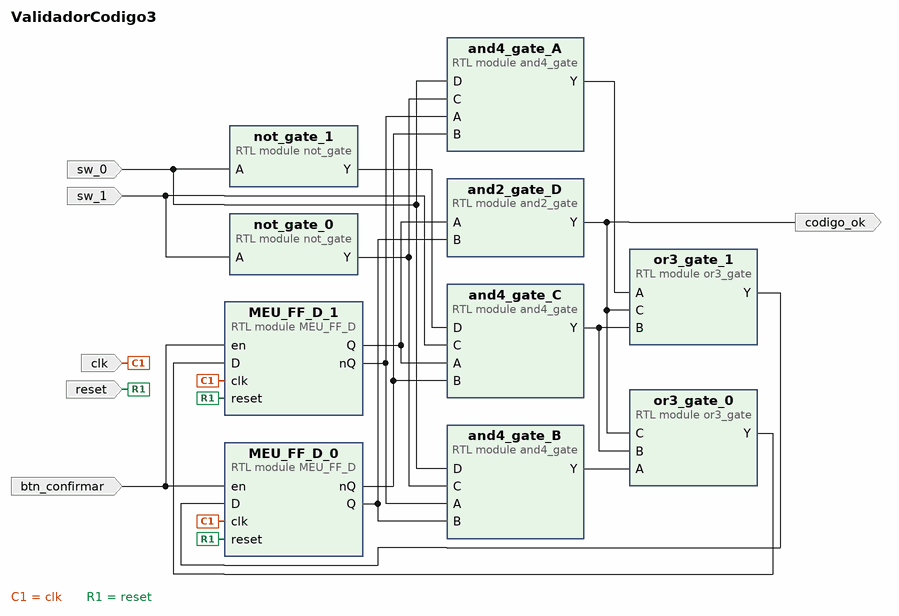
[diagram p0: block diagram of the top level]
# Vivado block design ValidadorCodigo3, xc7vx485tffg1157-1, Vivado 2025.1
create_bd_design ValidadorCodigo3

create_bd_port -dir I btn_confirmar
create_bd_port -dir I clk
create_bd_port -dir O codigo_ok
create_bd_port -dir I reset
create_bd_port -dir I sw_0
create_bd_port -dir I sw_1

create_bd_cell -type module -reference MEU_FF_D MEU_FF_D_0
create_bd_cell -type module -reference MEU_FF_D MEU_FF_D_1
create_bd_cell -type module -reference and2_gate and2_gate_D
create_bd_cell -type module -reference and4_gate and4_gate_A
create_bd_cell -type module -reference and4_gate and4_gate_B
create_bd_cell -type module -reference and4_gate and4_gate_C
create_bd_cell -type module -reference not_gate not_gate_0
create_bd_cell -type module -reference not_gate not_gate_1
create_bd_cell -type module -reference or3_gate or3_gate_0
create_bd_cell -type module -reference or3_gate or3_gate_1

# ---- connections ----

connect_bd_net [get_bd_pins MEU_FF_D_0/Q] [get_bd_pins and4_gate_B/B] [get_bd_pins and2_gate_D/B]
connect_bd_net [get_bd_pins MEU_FF_D_0/nQ] [get_bd_pins and4_gate_A/B] [get_bd_pins and4_gate_C/B]
connect_bd_net [get_bd_pins MEU_FF_D_1/Q] [get_bd_pins and4_gate_C/A] [get_bd_pins and2_gate_D/A]
connect_bd_net [get_bd_pins MEU_FF_D_1/nQ] [get_bd_pins and4_gate_A/A] [get_bd_pins and4_gate_B/A]
connect_bd_net [get_bd_pins and2_gate_D/Y] [get_bd_pins or3_gate_0/C] [get_bd_pins or3_gate_1/C] [get_bd_ports codigo_ok]
connect_bd_net [get_bd_pins and4_gate_A/Y] [get_bd_pins or3_gate_1/A]
connect_bd_net [get_bd_pins and4_gate_B/Y] [get_bd_pins or3_gate_0/A]
connect_bd_net [get_bd_pins and4_gate_C/Y] [get_bd_pins or3_gate_0/B] [get_bd_pins or3_gate_1/B]
connect_bd_net [get_bd_ports btn_confirmar] [get_bd_pins MEU_FF_D_0/en] [get_bd_pins MEU_FF_D_1/en]
connect_bd_net [get_bd_ports clk] [get_bd_pins MEU_FF_D_0/clk] [get_bd_pins MEU_FF_D_1/clk]
connect_bd_net -net n_sw1 [get_bd_pins not_gate_0/Y] [get_bd_pins and4_gate_A/C] [get_bd_pins and4_gate_B/C]
connect_bd_net [get_bd_pins not_gate_1/Y] [get_bd_pins and4_gate_C/D]
connect_bd_net [get_bd_pins or3_gate_0/Y] [get_bd_pins MEU_FF_D_1/D]
connect_bd_net [get_bd_pins or3_gate_1/Y] [get_bd_pins MEU_FF_D_0/D]
connect_bd_net [get_bd_ports reset] [get_bd_pins MEU_FF_D_0/reset] [get_bd_pins MEU_FF_D_1/reset]
connect_bd_net -net sw_0_1 [get_bd_ports sw_0] [get_bd_pins not_gate_1/A] [get_bd_pins and4_gate_A/D] [get_bd_pins and4_gate_B/D]
connect_bd_net -net sw_1_1 [get_bd_ports sw_1] [get_bd_pins not_gate_0/A] [get_bd_pins and4_gate_C/C]

validate_bd_design
save_bd_design
